# Altium schematic sheet Power.SchDoc
size A4; SheetNumber: 2; SheetTotal: 4
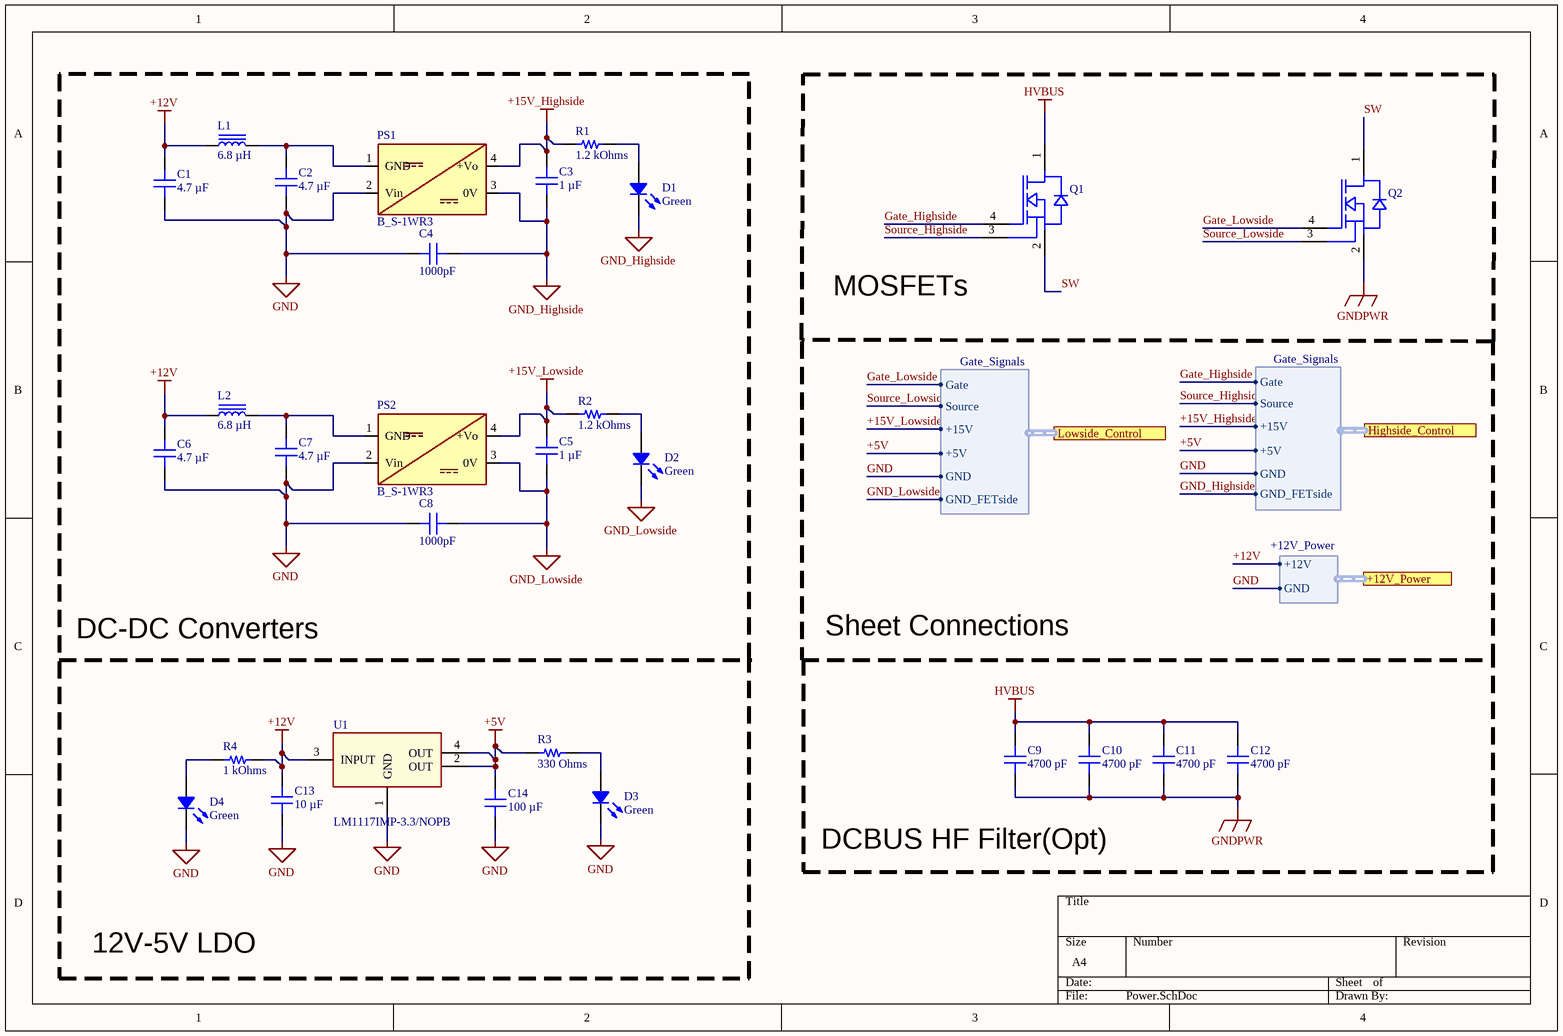
[diagram p0: Power.SchDoc]

## Parts
C1  4.7 µF  [CAP 0805_2012]
C2  4.7 µF  [CAP 0805_2012]
C3  1 µF  [CAP 0805_2012]
C4  1000pF  [CAP 1210_3225 - 1.8MM]
C5  1 µF  [CAP 0805_2012]
C6  4.7 µF  [CAP 0805_2012]
C7  4.7 µF  [CAP 0805_2012]
C8  1000pF  [CAP 1210_3225 - 1.8MM]
C9  4700 pF  [CAP 1206_3216 - 0.8MM]
C10  4700 pF  [CAP 1206_3216 - 0.8MM]
C11  4700 pF  [CAP 1206_3216 - 0.8MM]
C12  4700 pF  [CAP 1206_3216 - 0.8MM]
C13  10 µF  [CAP 0805_2012]
C14  100 µF  [CAP 0805_2012]
D1  Green  [LED 0805_2012 GREEN]
D2  Green  [LED 0805_2012 GREEN]
D3  Green  [LED 0805_2012 GREEN]
D4  Green  [LED 0805_2012 GREEN]
L1  6.8 µH  [TDK VLCF4024-2]
L2  6.8 µH  [TDK VLCF4024-2]
PS1  B_S-1WR3  [B_S-1WR3]
PS2  B_S-1WR3  [B_S-1WR3]
Q1  NTH4L015N065SC1  [NTH4L015N065SC1]  (value not drawn)
Q2  NTH4L015N065SC1  [NTH4L015N065SC1]  (value not drawn)
R1  1.2 kOhms  [RES 0805_2012]
R2  1.2 kOhms  [RES 0805_2012]
R3  330 Ohms  [RES 0805_2012]
R4  1 kOhms  [RES 0805_2012]
U1  LM1117IMP-3.3/NOPB  [DCY0004A_M]

## Blocks framed on the sheet
DC-DC Converters: C1-C8 D1 D2 L1 L2 PS1 PS2 R1 R2
MOSFETs: Q1 Q2

## Ports
+12V_Power (harness +12V_Power), Highside_Control (harness Gate_Signals), Lowside_Control (harness Gate_Signals)

## Harnesses
Gate_Signals: Gate, Source, +15V, +5V, GND, GND_FETside
+12V_Power: +12V, GND

## Nets
+5V: C14.2 R3.1 U1.2(OUT) U1.4(OUT) ; port Lowside_Control.+5V, port Highside_Control.+5V
+12V: C1.2 C6.2 C13.2 L1.1 L2.1 R4.2 U1.3(INPUT) ; port +12V_Power.+12V
+15V_Highside: C3.2 PS1.4(+Vo) R1.1 ; port Highside_Control.+15V
+15V_Lowside: C5.2 PS2.4(+Vo) R2.1 ; port Lowside_Control.+15V
GND: C1.1 C2.1 C4.1 C6.1 C7.1 C8.1 C13.1 C14.1 D3.2 D4.2 PS1.2(Vin) PS2.2(Vin) U1.1(GND) ; port Lowside_Control.GND, port Highside_Control.GND, port +12V_Power.GND
GND_Highside: C3.1 C4.2 D1.2 PS1.3(0V) ; port Highside_Control.GND_FETside
GND_Lowside: C5.1 C8.2 D2.2 PS2.3(0V) ; port Lowside_Control.GND_FETside
GNDPWR: C9.1 C10.1 C11.1 C12.1 Q2.2(S2)
HVBUS: C9.2 C10.2 C11.2 C12.2 Q1.1(D)
Gate_Highside: Q1.4(G) ; port Highside_Control.Gate
Gate_Lowside: Q2.4(G) ; port Lowside_Control.Gate
Source_Highside: Q1.3(S1) ; port Highside_Control.Source
Source_Lowside: Q2.3(S1) ; port Lowside_Control.Source
SW: Q1.2(S2) Q2.1(D)
NetC2_2: C2.2 L1.2 PS1.1(GND)
NetC7_2: C7.2 L2.2 PS2.1(GND)
NetD1_1: D1.1 R1.2
NetD2_1: D2.1 R2.2
NetD3_1: D3.1 R3.2
NetD4_1: D4.1 R4.1

## Notes on the sheet
- Sheet Connections
- DCBUS HF Filter(Opt)
- 12V-5V LDO

## Library data of the parts
C1 C2 C6 C7 = VJ0805V475ZXQTW1BC: CAP CER 4.7UF 10V Y5V 0805; manufacturer: Vishay Vitramon; Temperature Coefficient: Y5V (F); Tolerance: -20%, +80%; Part Number: VJ0805V475ZXQTW1BC; Value: 4.7 µF; Applications: General Purpose; Capacitance: 4.7 µF; componentlink1description: Datasheet; componentlink1url: https://www.vishay.com/docs/28548/vjw1bcbascomseries.pdf; componentlink2description: DigiKey Link; componentlink2url: https://www.digikey.com/en/products/detail/vishay-vitramon/VJ0805V475ZXQTW1BC/8310746; Device Package: 0805 (2012 Metric); lastupdated: 9.02.2024 20:15:54; Lifecycle Status: Active; Minimum Order: 1; Mounting Type: Surface Mount, MLCC; Operating Temperature: -25°C ~ 85°C; Package / Case: 0805 (2012 Metric); packaging: TapeAndReel; partid: 7977; Part Status: Active; price: 0.06; series: VJ; Size / Dimension: 0.079" L x 0.049" W (2.00mm x 1.25mm); Supplier 1: DigiKey; Supplier Part Number 1: 720-1738-1-ND; Thickness (Max): 0.053" (1.35mm); Voltage - Rated: 10V
C3 C5 = VJ0805Y105KXXTW1BC: CAP CER 1UF 25V X7R 0805; manufacturer: Vishay Vitramon; Tolerance: ±10%; Part Number: VJ0805Y105KXXTW1BC; Value: 1 µF; Applications: General Purpose; Capacitance: 1 µF; componentlink1description: Datasheet; componentlink1url: http://www.vishay.com/docs/28548/vjw1bcbascomseries.pdf; componentlink2description: DigiKey Link; componentlink2url: https://www.digikey.com/en/products/detail/vishay-vitramon/VJ0805Y105KXXTW1BC/9681488; Device Package: 0805 (2012 Metric); lastupdated: 9.02.2024 20:15:32; Lifecycle Status: Active; Minimum Order: 1; Mounting Type: Surface Mount, MLCC; Operating Temperature: -55°C ~ 125°C; Package / Case: 0805 (2012 Metric); packaging: TapeAndReel; partid: 15348; Part Status: Active; price: 0.02; series: VJ W1BC; Size / Dimension: 0.079" L x 0.049" W (2.00mm x 1.25mm); Supplier 1: DigiKey; Supplier Part Number 1: 720-VJ0805Y105KXXTW1BCCT-ND; Temperature Coefficient: X7R; Thickness (Max): 0.053" (1.35mm); Voltage - Rated: 25V
C4 C8 = 1210GC102MAT1A: CAP CER 1000PF 2KV X7R 1210; manufacturer: AVX Corporation; Tolerance: ±20%; Voltage - Rated: 2000V (2kV); Part Number: 1210GC102MAT1A; Value: 1000pF; Applications: General Purpose; Capacitance: 1000pF; componentlink1description: Datasheet; componentlink1url: http://datasheets.avx.com/AVX-HV_MLCC.pdf; componentlink2description: DigiKey Link; componentlink2url: http://digikey.com/product-detail/en/avx-corporation/1210GC102MAT1A/478-5184-1-ND/1913274; Device Package: 1210 (3225 Metric); Features: High Voltage; lastupdated: 2.09.2020 01:10:35; Lifecycle Status: Active; Minimum Order: 1; Mounting Type: Surface Mount, MLCC; Operating Temperature: -55°C ~ 125°C; Package / Case: 1210 (3225 Metric); packaging: TapeAndReel; partid: 24774; Part Status: Active; price: 0.30; series: -; Size / Dimension: 0.130" L x 0.098" W (3.30mm x 2.50mm); Supplier 1: DigiKey; Supplier Part Number 1: 478-5184-1-ND; Temperature Coefficient: X7R; Thickness (Max): 0.071" (1.80mm)
C9-C12 = C1206X472KDRACAUTO: CAP CER 4700PF 1KV X7R 1206; manufacturer: KEMET; Tolerance: ±10%; Voltage - Rated: 1000V (1kV); Part Number: C1206X472KDRACAUTO; Value: 4700 pF; Applications: Automotive, Boardflex Sensitive; Capacitance: 4700 pF; componentlink1description: Datasheet; componentlink1url: https://api.kemet.com/component-edge/download/datasheet/C1206X472KDRACAUTO.pdf; componentlink2description: DigiKey Link; componentlink2url: https://www.digikey.com/en/products/detail/kemet/C1206X472KDRACAUTO/8109916; Device Package: 1206 (3216 Metric); Features: Soft Termination, High Voltage; lastupdated: 4.06.2024 19:10:21; Lifecycle Status: Active; Minimum Order: 1; Mounting Type: Surface Mount, MLCC; Operating Temperature: -55°C ~ 125°C; Package / Case: 1206 (3216 Metric); packaging: TapeAndReel; partid: 19261; Part Status: Active; price: 0.19; Ratings: AEC-Q200; series: SMD Auto X7R HV Flex; Size / Dimension: 0.130" L x 0.063" W (3.30mm x 1.60mm); Supplier 1: DigiKey; Supplier Part Number 1: 399-16735-1-ND; Temperature Coefficient: X7R; Thickness (Max): 0.047" (1.20mm)
C13 = TMK212BC6106MG-T: CAP CER 10UF 25V X6S 0805; manufacturer: Taiyo Yuden; Tolerance: ±20%; Part Number: TMK212BC6106MG-T; Value: 10 µF; Applications: SMPS Filtering; Capacitance: 10 µF; componentlink1description: Datasheet; componentlink1url: https://ds.yuden.co.jp/TYCOMPAS/ut/detail?pn=TMK212BC6106MG-T&u=M; componentlink2description: DigiKey Link; componentlink2url: https://www.digikey.com/en/products/detail/taiyo-yuden/TMK212BC6106MG-T/11675671; Device Package: 0805 (2012 Metric); lastupdated: 9.02.2024 20:15:02; Lifecycle Status: Active; Minimum Order: 1; Mounting Type: Surface Mount, MLCC; Operating Temperature: -55°C ~ 105°C; Package / Case: 0805 (2012 Metric); packaging: TapeAndReel; partid: 31493; Part Status: Active; price: 0.17; series: M; Size / Dimension: 0.079" L x 0.049" W (2.00mm x 1.25mm); Supplier 1: DigiKey; Supplier Part Number 1: 587-TMK212BC6106MG-TCT-ND; Temperature Coefficient: X6S; Thickness (Max): 0.057" (1.45mm); Voltage - Rated: 25V
C14 = MSASJ21GBB5107MTCA01: CAP CER 100UF 6.3V X5R 0805; manufacturer: Taiyo Yuden; Tolerance: ±20%; Part Number: MSASJ21GBB5107MTCA01; Value: 100 µF; Applications: SMPS Filtering; Capacitance: 100 µF; componentlink2description: DigiKey Link; componentlink2url: https://www.digikey.com/en/products/detail/taiyo-yuden/MSASJ21GBB5107MTCA01/16664806; Device Package: 0805 (2012 Metric); lastupdated: 9.02.2024 20:14:44; Lifecycle Status: Active; Minimum Order: 3000; Mounting Type: Surface Mount, MLCC; Operating Temperature: -55°C ~ 85°C; Package / Case: 0805 (2012 Metric); packaging: TapeAndReel; partid: 48730; Part Status: Active; price: 0.52; series: MSAS; Size / Dimension: 0.079" L x 0.049" W (2.00mm x 1.25mm); Supplier 1: DigiKey; Supplier Part Number 1: 587-MSASJ21GBB5107MTCA01TR-ND; Temperature Coefficient: X5R; Thickness (Max): 0.057" (1.45mm); Voltage - Rated: 6.3V
D1-D4 = HSMQ-C170: LED GREEN DIFFUSED CHIP SMD; Manufacturer: Broadcom Limited; Configuration: Standard; Current - Test: 20mA; Lens Color: White; Lens Size: 1.40mm x 1.25mm; Lens Style: Rectangle with Flat Top; Millicandela Rating: 145mcd; Viewing Angle: 140°; Voltage - Forward (Vf) (Typ): 3.4V; Wavelength - Dominant: 527nm; Wavelength - Peak: 520nm; Part Number: HSMQ-C170; Color: Green; ComponentLink1Description: Datasheet; ComponentLink1URL: https://docs.broadcom.com/docs/AV02-0977EN; ComponentLink2Description: DigiKey Link; ComponentLink2URL: https://www.digikey.com/en/products/detail/broadcom-limited/HSMQ-C170/1235197; Device Package: 0805 (2012 Metric); Height (Max): 0.80mm; LastUpdated: 3.06.2024 20:00:29; Lens Transparency: Diffused; Lifecycle Status: Active; Minimum Order: 1; Mounting Type: Surface Mount; Package / Case: 0805 (2012 Metric); Packaging: TapeAndReel; PartId: 256; Part Status: Active; Price: 0.38; Series: -; Size / Dimension: 2.00mm L x 1.25mm W; Supplier 1: DigiKey; Supplier Part Number 1: 516-3071-1-ND; Supplier Device Package: Chip LED; Value: Green
L1 L2 = VLCF4024T-6R8N1R1-2: FIXED IND 6.8UH 1.15A 116MOHM SM; Manufacturer: TDK Corporation; DC Resistance (DCR): 116mOhm Max; Inductance Frequency - Test: 100 kHz; Material - Core: Ferrite; Shielding: Shielded; Tolerance: ±30%; Type: Drum Core, Wirewound; Part Number: VLCF4024T-6R8N1R1-2; ComponentLink1Description: Datasheet; ComponentLink1URL: https://product.tdk.com/info/en/catalog/datasheets/inductor_commercial_power_vlcf4024-2_en.pdf?ref_disty=digikey; ComponentLink2Description: DigiKey Link; ComponentLink2URL: https://www.digikey.com/en/products/detail/tdk-corporation/VLCF4024T-6R8N1R1-2/3083280; Current Rating (Amps): 1.15 A; Current - Saturation: 1.15A; Device Package: Nonstandard; Height - Seated (Max): 0.094" (2.40mm); Inductance: 6.8 µH; LastUpdated: 3.06.2024 20:02:43; Lifecycle Status: Active; Minimum Order: 1; Mounting Type: Surface Mount; Operating Temperature: -40°C ~ 105°C; Package / Case: Nonstandard; Packaging: TapeAndReel; PartId: 160; Part Status: Active; Price: 0.30; Series: VLCF; Size / Dimension: 0.157" L x 0.157" W (4.00mm x 4.00mm); Supplier 1: DigiKey; Supplier Part Number 1: 445-8738-1-ND; Value: 6.8 µH
Q1 Q2 = NTH4L015N065SC1: Max RDS(on) = 18.7 m at Vgs = 18V, Id = 60A; High Junction Temperature; 100% UIL Tested; RoHS Compliant; High Speed Switching and Low Capacitance; 650V rated; Manufacturer_Name: onsemi; Geometry.Height: 25.56mm; Manufacturer_Part_Number: NTH4L015N065SC1; Mouser Part Number: 863-NTH4L015N065SC1; Mouser Price/Stock: https://www.mouser.co.uk/ProductDetail/onsemi/NTH4L015N065SC1?qs=stqOd1AaK7%252BX4HlQwOMOTg%3D%3D; Arrow Part Number: NTH4L015N065SC1; Arrow Price/Stock: https://www.arrow.com/en/products/nth4l015n065sc1/on-semiconductor?region=nac; Datasheet Link: https://www.onsemi.com/pub/Collateral/NTH4L015N065SC1-D.PDF
R1 R2 = CPF0805B1K2E1: RES SMD 1.2K OHM 0.1% 1/10W 0805; Manufacturer: TE Connectivity Passive Product; Power (Watts): 0.1W, 1/10W; Temperature Coefficient: ±25ppm/°C; Part Number: CPF0805B1K2E1; Value: 1.2 kOhms; ComponentLink1Description: Datasheet; ComponentLink1URL: https://www.te.com/commerce/DocumentDelivery/DDEController?Action=srchrtrv&DocNm=1773200&DocType=DS&DocLang=English; ComponentLink2Description: DigiKey Link; ComponentLink2URL: https://www.digikey.com/en/products/detail/te-connectivity-passive-product/CPF0805B1K2E1/2382033; Composition: Thin Film; Device Package: 0805 (2012 Metric); Height - Seated (Max): 0.026" (0.65mm); LastUpdated: 8.02.2024 21:00:58; Lifecycle Status: Active; Minimum Order: 1; Number of Terminations: 2; Operating Temperature: -55°C ~ 155°C; Package / Case: 0805 (2012 Metric); Packaging: TapeAndReel; PartId: 48602; Part Status: Active; Price: 0.12; Resistance: 1.2 kOhms; Series: CPF, Neohm; Size / Dimension: 0.079" L x 0.049" W (2.00mm x 1.25mm); Supplier 1: DigiKey; Supplier Part Number 1: A103167CT-ND; Supplier Device Package: 0805; Tolerance: ±0.1%
R3 = CPF0805B330RE1: RES SMD 330 OHM 0.1% 1/10W 0805; Manufacturer: TE Connectivity Passive Product; Power (Watts): 0.1W, 1/10W; Temperature Coefficient: ±25ppm/°C; Part Number: CPF0805B330RE1; Value: 330 Ohms; ComponentLink1Description: Datasheet; ComponentLink1URL: https://www.te.com/commerce/DocumentDelivery/DDEController?Action=srchrtrv&DocNm=1773200&DocType=DS&DocLang=English; ComponentLink2Description: DigiKey Link; ComponentLink2URL: https://www.digikey.com/en/products/detail/te-connectivity-passive-product/CPF0805B330RE1/2382020; Composition: Thin Film; Device Package: 0805 (2012 Metric); Height - Seated (Max): 0.026" (0.65mm); LastUpdated: 8.02.2024 21:01:14; Lifecycle Status: Active; Minimum Order: 1; Number of Terminations: 2; Operating Temperature: -55°C ~ 155°C; Package / Case: 0805 (2012 Metric); Packaging: TapeAndReel; PartId: 46733; Part Status: Active; Price: 0.12; Resistance: 330 Ohms; Series: CPF, Neohm; Size / Dimension: 0.079" L x 0.049" W (2.00mm x 1.25mm); Supplier 1: DigiKey; Supplier Part Number 1: A103195CT-ND; Supplier Device Package: 0805; Tolerance: ±0.1%
R4 = 1-2176092-8: RES SMD 1K OHM 0.1% 1/4W 0805; Manufacturer: TE Connectivity Passive Product; Power (Watts): 0.25W, 1/4W; Temperature Coefficient: ±25ppm/°C; Part Number: 1-2176092-8; Value: 1 kOhms; ComponentLink1Description: Datasheet; ComponentLink1URL: https://www.te.com/commerce/DocumentDelivery/DDEController?Action=srchrtrv&DocNm=1773272&DocType=DS&DocLang=English; ComponentLink2Description: DigiKey Link; ComponentLink2URL: https://www.digikey.com/en/products/detail/te-connectivity-passive-product/1-2176092-8/4034011; Composition: Thin Film; Device Package: 0805 (2012 Metric); Height - Seated (Max): 0.026" (0.65mm); LastUpdated: 8.02.2024 21:02:35; Lifecycle Status: Active; Minimum Order: 1; Number of Terminations: 2; Operating Temperature: -55°C ~ 155°C; Package / Case: 0805 (2012 Metric); Packaging: TapeAndReel; PartId: 28484; Part Status: Active; Price: 0.14; Resistance: 1 kOhms; Series: RP73P, Holsworthy; Size / Dimension: 0.079" L x 0.049" W (2.00mm x 1.25mm); Supplier 1: DigiKey; Supplier Part Number 1: A110543CT-ND; Supplier Device Package: 0805; Tolerance: ±0.1%
U1 = LM1117IMP-3.3NOPB: 800-mA 15-V linear voltage regulator 4-SOT-223 -40 to 125; Manufacturer_Name: Texas Instruments; TYPE: TYPE; RefDes: RefDes; Copyright: Copyright (C) 2025 Ultra Librarian. All rights reserved.; Manufacturer_Part_Number: LM1117IMP-3.3/NOPB; Datasheet: https://www.ti.com/lit/gpn/lm1117